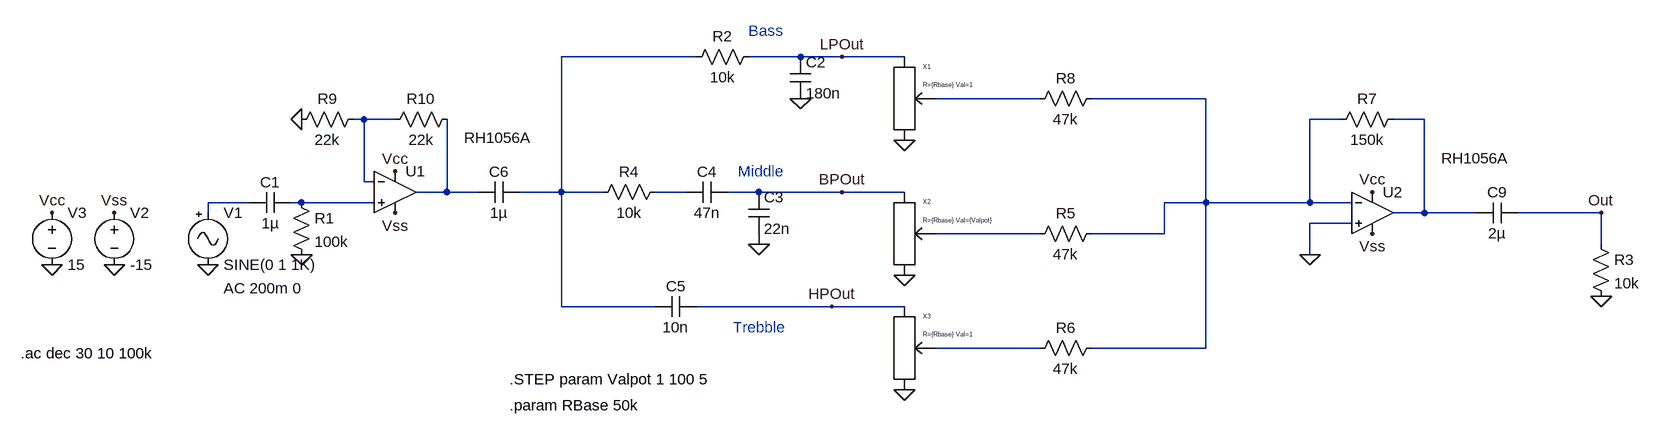
[diagram p0: schematic PassiveTMBInputTonestack.asc]
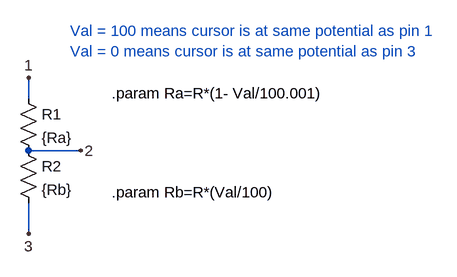
[diagram p1: sub-circuit potentiometer.asc]
PassiveTMBInputTonestack.asc, the LTspice schematic file:
Version 4
SHEET 1 1940 972
WIRE 384 -192 176 -192
WIRE 544 -192 464 -192
WIRE 608 -192 544 -192
WIRE 704 -192 608 -192
WIRE 912 -128 752 -128
WIRE 1168 -128 992 -128
WIRE -128 -96 -144 -96
WIRE -80 -96 -128 -96
WIRE 1376 -96 1328 -96
WIRE 1504 -96 1456 -96
WIRE -128 0 -128 -96
WIRE -112 0 -128 0
WIRE 0 16 0 -96
WIRE 0 16 -48 16
WIRE 48 16 0 16
WIRE 176 16 176 -192
WIRE 176 16 112 16
WIRE 240 16 176 16
WIRE 368 16 320 16
WIRE 480 16 432 16
WIRE 608 16 480 16
WIRE 704 16 608 16
WIRE -304 32 -368 32
WIRE -224 32 -240 32
WIRE -112 32 -224 32
WIRE 1168 32 1168 -128
WIRE 1168 32 1104 32
WIRE 1328 32 1328 -96
WIRE 1328 32 1168 32
WIRE 1392 32 1328 32
WIRE -368 48 -368 32
WIRE 1504 48 1504 -96
WIRE 1504 48 1456 48
WIRE 1584 48 1504 48
WIRE 1776 48 1648 48
WIRE 1392 64 1328 64
WIRE 912 80 752 80
WIRE 1104 80 1104 32
WIRE 1104 80 992 80
WIRE 480 96 480 80
WIRE 1776 96 1776 48
WIRE 1328 112 1328 64
WIRE 176 192 176 16
WIRE 320 192 176 192
WIRE 592 192 384 192
WIRE 704 192 592 192
WIRE 912 256 752 256
WIRE 1168 256 1168 32
WIRE 1168 256 992 256
FLAG -608 128 0
FLAG -512 128 0
FLAG -368 128 0
FLAG -608 48 Vcc
FLAG -512 48 Vss
FLAG -80 -16 Vcc
FLAG -80 48 Vss
FLAG -224 112 0
FLAG 1776 176 0
FLAG 1776 48 Out
FLAG 544 -128 0
FLAG 480 96 0
FLAG 704 -64 0
FLAG 704 144 0
FLAG 704 320 0
FLAG 1424 16 Vcc
FLAG 1424 80 Vss
FLAG 1328 112 0
FLAG -224 -96 0
FLAG 608 16 BPOut
FLAG 608 -192 LPOut
FLAG 592 192 HPOut
SYMBOL OpAmps\\RH1056A -80 -48 R0
WINDOW 3 106 -20 Left 2
SYMATTR InstName U1
SYMBOL Misc\\signal -368 32 R0
WINDOW 123 24 132 Left 2
WINDOW 39 0 0 Left 0
SYMATTR Value2 AC 200m 0
SYMATTR InstName V1
SYMBOL voltage -512 32 R0
WINDOW 123 0 0 Left 0
WINDOW 39 0 0 Left 0
SYMATTR InstName V2
SYMATTR Value -15
SYMBOL voltage -608 32 R0
WINDOW 123 0 0 Left 0
WINDOW 39 0 0 Left 0
SYMATTR InstName V3
SYMATTR Value 15
SYMBOL cap -240 16 R90
WINDOW 0 0 32 VBottom 2
WINDOW 3 32 32 VTop 2
SYMATTR InstName C1
SYMATTR Value 1µ
SYMBOL res -240 16 R0
SYMATTR InstName R1
SYMATTR Value 100k
SYMBOL res 1760 80 R0
SYMATTR InstName R3
SYMATTR Value 10k
SYMBOL cap 1648 32 R90
WINDOW 0 0 32 VBottom 2
WINDOW 3 32 32 VTop 2
SYMATTR InstName C9
SYMATTR Value 2µ
SYMBOL res 480 -208 R90
WINDOW 0 0 56 VBottom 2
WINDOW 3 32 56 VTop 2
SYMATTR InstName R2
SYMATTR Value 10k
SYMBOL cap 528 -192 R0
SYMATTR InstName C2
SYMATTR Value 180n
SYMBOL res 336 0 R90
WINDOW 0 0 56 VBottom 2
WINDOW 3 32 56 VTop 2
SYMATTR InstName R4
SYMATTR Value 10k
SYMBOL cap 464 16 R0
SYMATTR InstName C3
SYMATTR Value 22n
SYMBOL cap 432 0 R90
WINDOW 0 0 32 VBottom 2
WINDOW 3 32 32 VTop 2
SYMATTR InstName C4
SYMATTR Value 47n
SYMBOL cap 384 176 R90
WINDOW 0 0 32 VBottom 2
WINDOW 3 32 32 VTop 2
SYMATTR InstName C5
SYMATTR Value 10n
SYMBOL Potentiometer 704 -128 R0
WINDOW 39 28 -21 Left 0
SYMATTR SpiceLine R={Rbase} Val=1
SYMATTR InstName X1
SYMBOL Potentiometer 704 80 R0
WINDOW 39 28 -21 Left 0
SYMATTR SpiceLine R={Rbase} Val={Valpot}
SYMATTR InstName X2
SYMBOL Potentiometer 704 256 R0
WINDOW 39 28 -21 Left 0
SYMATTR SpiceLine R={Rbase} Val=1
SYMATTR InstName X3
SYMBOL OpAmps\\RH1056A 1424 -16 R0
WINDOW 3 106 -20 Left 2
SYMATTR InstName U2
SYMBOL res 1472 -112 R90
WINDOW 0 0 56 VBottom 2
WINDOW 3 32 56 VTop 2
SYMATTR InstName R7
SYMATTR Value 150k
SYMBOL cap 112 0 R90
WINDOW 0 0 32 VBottom 2
WINDOW 3 32 32 VTop 2
SYMATTR InstName C6
SYMATTR Value 1µ
SYMBOL res 1008 -144 R90
WINDOW 0 0 56 VBottom 2
WINDOW 3 32 56 VTop 2
SYMATTR InstName R8
SYMATTR Value 47k
SYMBOL res 1008 64 R90
WINDOW 0 0 56 VBottom 2
WINDOW 3 32 56 VTop 2
SYMATTR InstName R5
SYMATTR Value 47k
SYMBOL res 1008 240 R90
WINDOW 0 0 56 VBottom 2
WINDOW 3 32 56 VTop 2
SYMATTR InstName R6
SYMATTR Value 47k
SYMBOL res -128 -112 R90
WINDOW 0 0 56 VBottom 2
WINDOW 3 32 56 VTop 2
SYMATTR InstName R9
SYMATTR Value 22k
SYMBOL res 16 -112 R90
WINDOW 0 0 56 VBottom 2
WINDOW 3 32 56 VTop 2
SYMATTR InstName R10
SYMATTR Value 22k
TEXT -656 264 Left 2 !.ac dec 30 10 100k
TEXT 96 304 Left 2 !.STEP param Valpot 1 100 5
TEXT 96 344 Left 2 !.param RBase 50k
TEXT 440 224 Left 2 ;Trebble
TEXT 448 -16 Left 2 ;Middle
TEXT 464 -232 Left 2 ;Bass

potentiometer.asc, the sub-circuit schematic file:
Version 4
SHEET 1 908 680
WIRE 192 96 192 64
WIRE 272 176 192 176
WIRE 192 304 192 256
FLAG 192 64 1
FLAG 272 176 2
FLAG 192 304 3
SYMBOL res 176 80 R0
SYMATTR InstName R1
SYMATTR Value {Ra}
SYMBOL res 176 160 R0
SYMATTR InstName R2
SYMATTR Value {Rb}
TEXT 320 88 Left 2 !.param Ra=R*(1- Val/100.001)
TEXT 320 240 Left 2 !.param Rb=R*(Val/100)
TEXT 256 -8 Left 2 ;Val = 100 means cursor is at same potential as pin 1\nVal = 0 means cursor is at same potential as pin 3

The netlist it stands for:
* PassiveTMBInputTonestack.asc
XU1 N009 N004 Vcc Vss N006 RH1056A  ; pins In+ In- V+ V- OUT
V1 N008 0 SINE(0 1 1K) AC 200m 0
V2 Vss 0 -15
V3 Vcc 0 15
C1 N009 N008 1µ
R1 N009 0 100k
R3 Out 0 10k
C9 Out N005 2µ
R2 LPOut N001 10k
C2 LPOut 0 180n
R4 N007 N001 10k
C3 BPOut 0 22n
C4 BPOut N007 47n
C5 HPOut N001 10n
XX1 LPOut N002 0 potentiometer params: R={Rbase} Val=1
XX2 BPOut N010 0 potentiometer params: R={Rbase} Val={Valpot}
XX3 HPOut N011 0 potentiometer params: R={Rbase} Val=1
XU2 0 N003 Vcc Vss N005 RH1056A  ; pins In+ In- V+ V- OUT
R7 N005 N003 150k
C6 N001 N006 1µ
R8 N003 N002 47k
R5 N003 N010 47k
R6 N003 N011 47k
R9 N004 0 22k
R10 N006 N004 22k

* block symbol definitions
.subckt potentiometer 1 2 3
R1 1 2 {Ra}
R2 2 3 {Rb}
.param Ra=R*(1- Val/100.001)
.param Rb=R*(Val/100)
* Val = 100 means cursor is at same potential as pin 1
* Val = 0 means cursor is at same potential as pin 3
.ends potentiometer

.ac dec 30 10 100k
.STEP param Valpot 1 100 5
.param RBase 50k
* Trebble
* Middle
* Bass
.backanno
.end